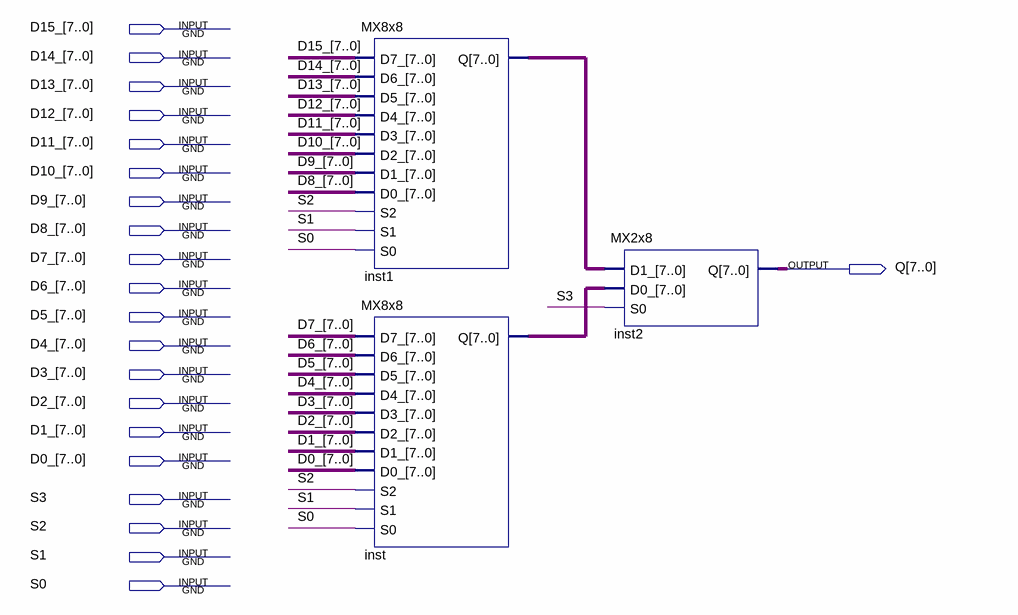
[diagram p0: schematic sheet]
// Quartus schematic MX16x8.bdf as structural Verilog: 3 symbols, 21 pins
module MX16x8 (
  input  [7:0] D15_,
  input  [7:0] D14_,
  input  [7:0] D13_,
  input  [7:0] D12_,
  input  [7:0] D11_,
  input  [7:0] D10_,
  input  [7:0] D9_,
  input  [7:0] D8_,
  input  [7:0] D7_,
  input  [7:0] D6_,
  input  [7:0] D5_,
  input  [7:0] D4_,
  input  [7:0] D3_,
  input  [7:0] D2_,
  input  [7:0] D1_,
  input  [7:0] D0_,
  input  S3,
  input  S2,
  input  S1,
  input  S0,
  output [7:0] Q
);

  wire [7:0] inst1_q, inst_q;

  MX8x8 inst1 (
    .D7_(D15_), .D6_(D14_), .D5_(D13_), .D4_(D12_), .D3_(D11_), .D2_(D10_), .D1_(D9_), .D0_(D8_), .S2(S2),
    .S1(S1), .S0(S0), .Q(inst1_q));
  MX8x8 inst (
    .D7_(D7_), .D6_(D6_), .D5_(D5_), .D4_(D4_), .D3_(D3_), .D2_(D2_), .D1_(D1_), .D0_(D0_), .S2(S2), .S1(S1),
    .S0(S0), .Q(inst_q));
  MX2x8 inst2 (.D1_(inst1_q), .D0_(inst_q), .S0(S3), .Q(Q));
endmodule
